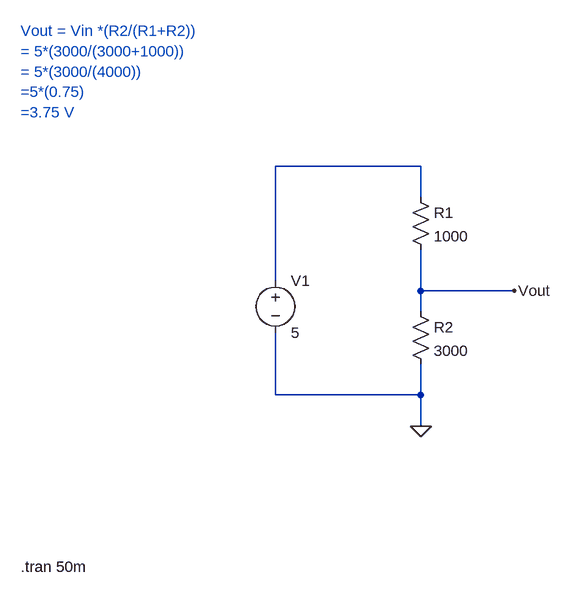
[diagram p0: schematic VoltageDivider.asc]
VoltageDivider.asc, the LTspice schematic file:
Version 4.1
SHEET 1 880 952
WIRE 16 320 -208 320
WIRE 16 368 16 320
WIRE -208 496 -208 320
WIRE 16 512 16 448
WIRE 160 512 16 512
WIRE 16 544 16 512
WIRE -208 672 -208 576
WIRE 16 672 16 624
WIRE 16 672 -208 672
WIRE 16 720 16 672
FLAG 16 720 0
FLAG 160 512 Vout
SYMBOL res 0 352 R0
SYMATTR InstName R1
SYMATTR Value 1000
SYMBOL res 0 528 R0
SYMATTR InstName R2
SYMATTR Value 3000
SYMBOL voltage -208 480 R0
WINDOW 123 0 0 Left 0
WINDOW 39 0 0 Left 0
SYMATTR InstName V1
SYMATTR Value 5
TEXT -600 112 Left 2 ;Vout = Vin *(R2/(R1+R2))\n= 5*(3000/(3000+1000))\n= 5*(3000/(4000))\n=5*(0.75)\n=3.75 V
TEXT -600 936 Left 2 !.tran 50m

The netlist it stands for:
* VoltageDivider.asc
R1 N001 Vout 1000
R2 Vout 0 3000
V1 N001 0 5
* Vout = Vin *(R2/(R1+R2))
* = 5*(3000/(3000+1000))
* = 5*(3000/(4000))
* =5*(0.75)
* =3.75 V
.tran 50m
.backanno
.end